# Altium schematic sheet ESP8266.SchDoc
size A4
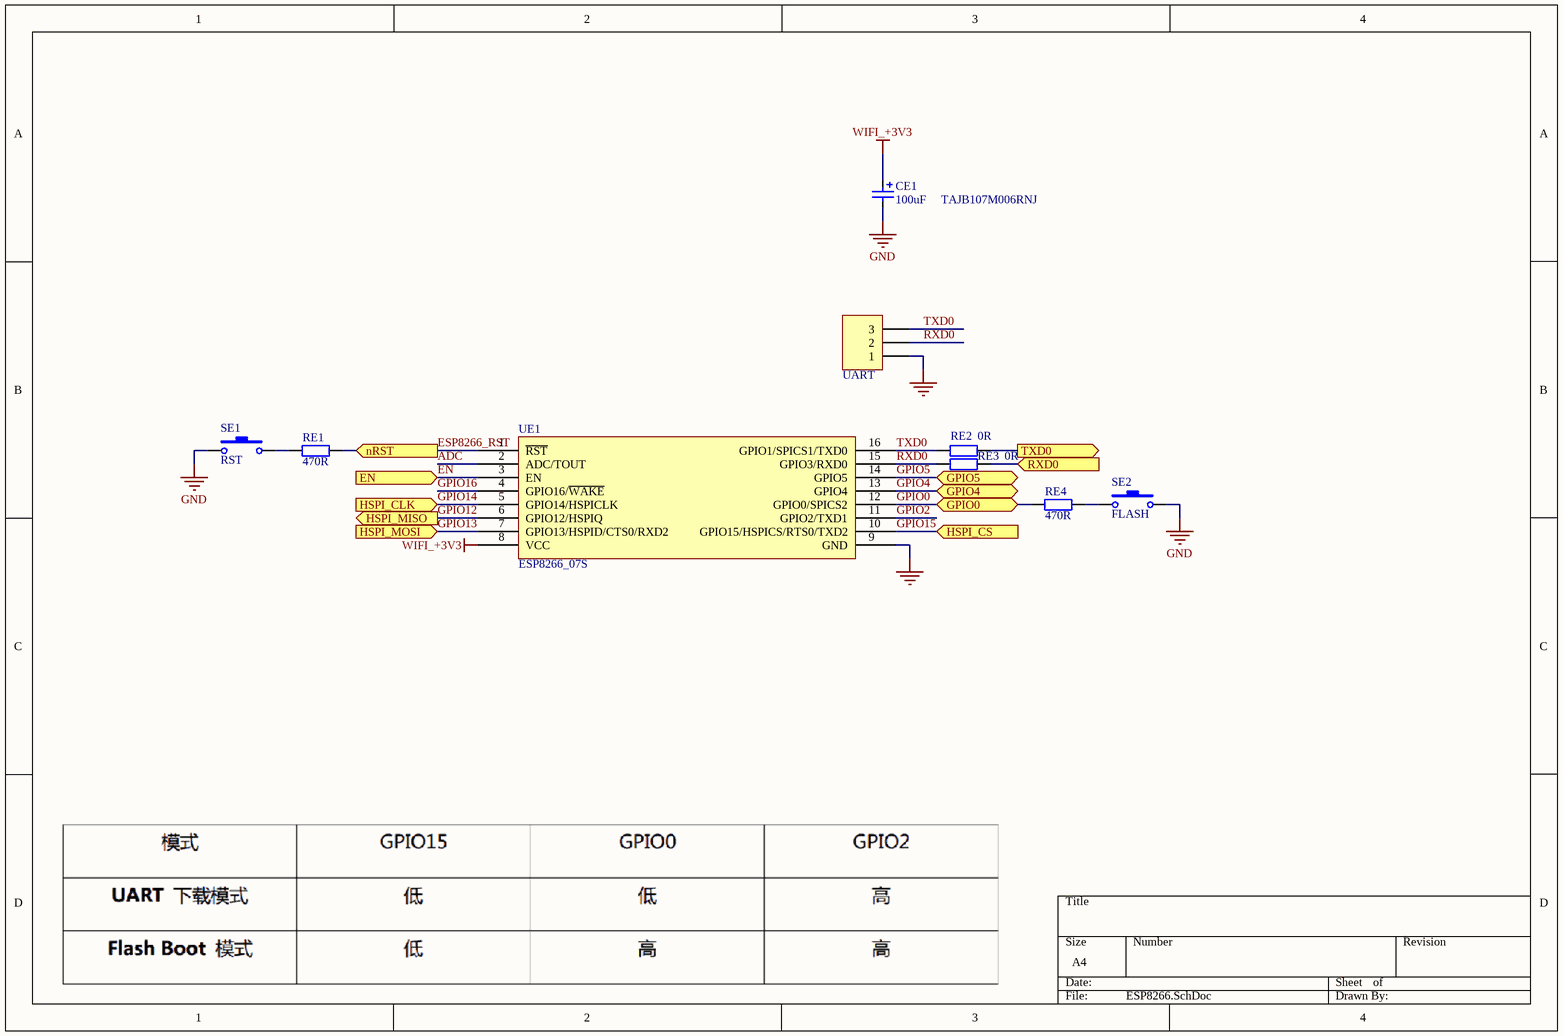
[diagram p0: ESP8266.SchDoc]

## Parts
CE1  value 100uF     TAJB107M006RNJ  [CAP_TAN_B_3518]  (hidden comment: Cap_Tan)
RE1  value 470R  [RESC1608N]  (hidden comment: Res1)
RE2  value 0R  [RESC1608N]  (hidden comment: Res1)
RE3  value 0R  [RESC1608N]  (hidden comment: Res1)
RE4  value 470R  [RESC1608N]  (hidden comment: Res1)
SE1  RST  [SW-3x6]
SE2  FLASH  [SW-3x6]
UART  Header 3  [HDR1X3]  (value not drawn)
UE1  ESP8266_07S  [ESP8266_07S]

## Ports
EN (in), GPIO0 (bidir), GPIO4 (bidir), GPIO5 (bidir), HSPI_CLK (in), HSPI_CS (in), HSPI_MISO (out), HSPI_MOSI (in), nRST (in), RXD0 (in), TXD0 (out)

## Nets
GND: CE1.2 SE1.2 SE2.2 UART.1 UE1.9(GND)
WIFI_+3V3: CE1.1 UE1.8(VCC)
ADC: UE1.2(ADC/TOUT)
EN: UE1.3(EN) ; port EN
ESP8266_RST: RE1.1 UE1.1(~{RST}) ; port nRST
GPIO0: RE4.1 UE1.12(GPIO0/SPICS2) ; port GPIO0
GPIO2: UE1.11(GPIO2/TXD1)
GPIO4: UE1.13(GPIO4) ; port GPIO4
GPIO5: UE1.14(GPIO5) ; port GPIO5
GPIO12: UE1.6(GPIO12/HSPIQ) ; port HSPI_MISO
GPIO13: UE1.7(GPIO13/HSPID/CTS0/RXD2) ; port HSPI_MOSI
GPIO14: UE1.5(GPIO14/HSPICLK) ; port HSPI_CLK
GPIO15: UE1.10(GPIO15/HSPICS/RTS0/TXD2) ; port HSPI_CS
GPIO16: UE1.4(GPIO16/~{WAKE})
RXD0: RE3.1 UART.2 UE1.15(GPIO3/RXD0)
RXD0: RE3.2 ; port RXD0  [a separate net that carries the same name]
TXD0: RE2.1 UART.3 UE1.16(GPIO1/SPICS1/TXD0)
TXD0: RE2.2 ; port TXD0  [a separate net that carries the same name]
NetRE1_2: RE1.2 SE1.1
NetRE4_2: RE4.2 SE2.1

## Library data of the parts
CE1 = Cap_Tan: Capacitor
RE1-RE4 = Res1: Resistor; Published: 8-Jun-2000; LatestRevisionDate: 17-Jul-2002; LatestRevisionNote: Re-released for DXP Platform.; PackageReference: AXIAL-0.4; Publisher: Altium Limited
SE1 SE2 = SW-PB: Switch; Published: 24-Mar-1999; LatestRevisionDate: 17-Jul-2002; LatestRevisionNote: Re-released for DXP Platform.; PackageReference: SPST-2; Publisher: Altium Limited; PackageDescription: Switch; 2 Leads
UART = Header 3: Header, 3-Pin; LatestRevisionDate: 17-Jul-2002; LatestRevisionNote: Re-released for DXP Platform.; Publisher: Altium Limited